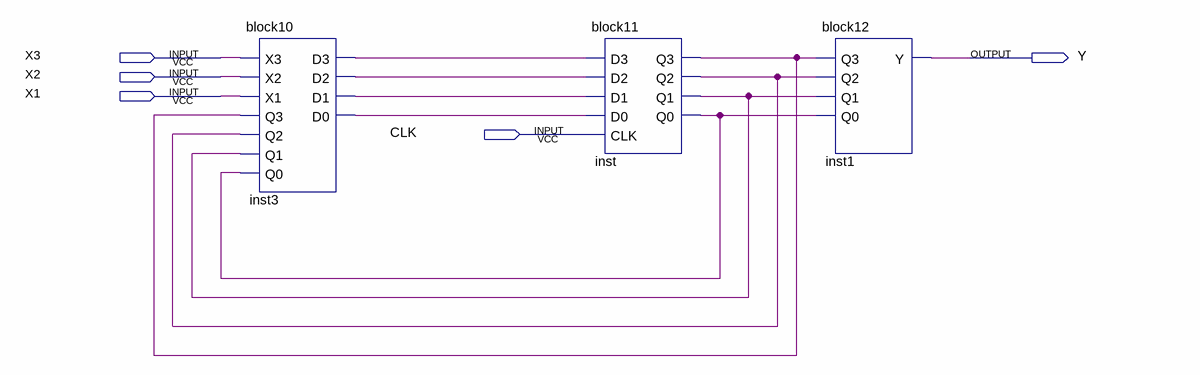
[diagram p0: schematic sheet]
// Quartus schematic block_cuoi.bdf as structural Verilog: 3 symbols, 5 pins
module block_cuoi (
  input  X3,
  input  X2,
  input  X1,
  input  CLK,
  output Y
);

  wire inst3_d0, inst3_d1, inst3_d2, inst3_d3, inst_q0, inst_q1, inst_q2, inst_q3;

  block10 inst3 (
    .X3(X3), .X2(X2), .X1(X1), .Q3(inst_q3), .Q2(inst_q2), .Q1(inst_q1), .Q0(inst_q0), .D3(inst3_d3),
    .D2(inst3_d2), .D1(inst3_d1), .D0(inst3_d0));
  block11 inst (
    .D3(inst3_d3), .D2(inst3_d2), .D1(inst3_d1), .D0(inst3_d0), .CLK(CLK), .Q3(inst_q3), .Q2(inst_q2),
    .Q1(inst_q1), .Q0(inst_q0));
  block12 inst1 (.Q3(inst_q3), .Q2(inst_q2), .Q1(inst_q1), .Q0(inst_q0), .Y(Y));
endmodule
